# EAGLE design EXT-PHY (EAGLE 9.6.2)
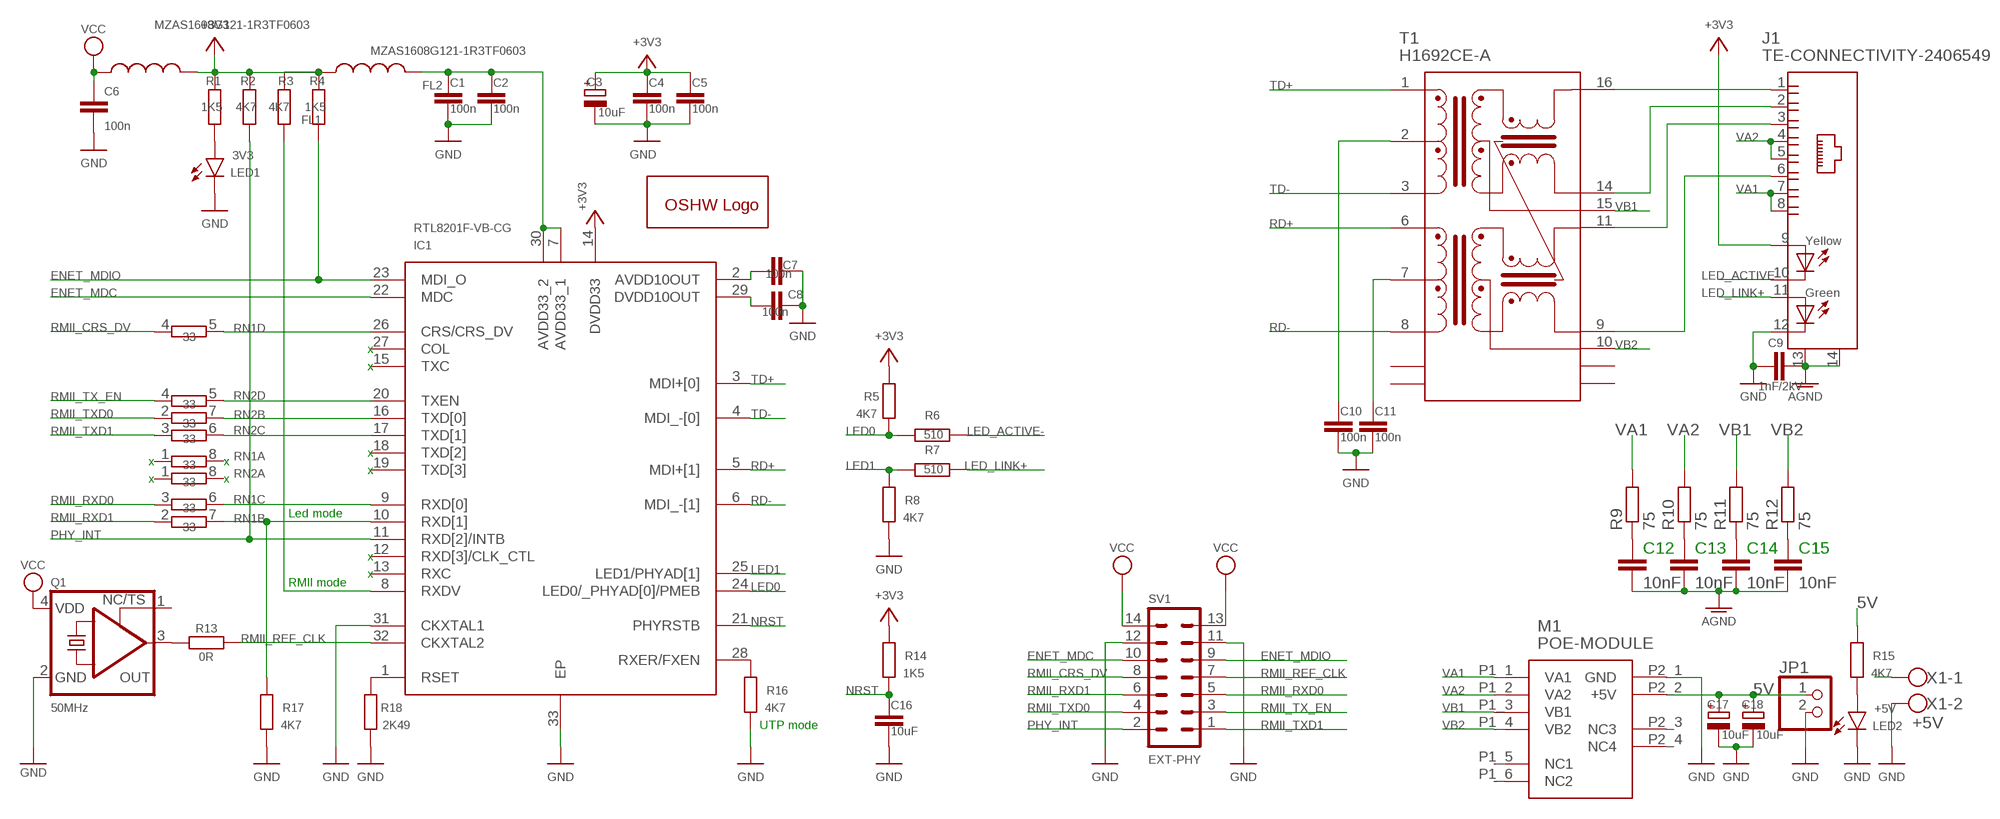
[diagram p0: schematic, sheet 1]

## Parts
C1  100n  C-EUC0603  [C0603]
C2  100n  C-EUC0603  [C0603]
C3  10uF  CPOL-EUA/3216-18R  [A/3216-18R]
C4  100n  C-EUC0603  [C0603]
C5  100n  C-EUC0603  [C0603]
C6  100n  C-EUC0603  [C0603]
C7  100n  C-EUC0603  [C0603]
C8  100n  C-EUC0603  [C0603]
C9  1nF/2kV  C-EUC1206  [C1206]
C10  100n  C-EUC0603  [C0603]
C11  100n  C-EUC0603  [C0603]
C12  10nF  C-EUC0805  [C0805]
C13  10nF  C-EUC0805  [C0805]
C14  10nF  C-EUC0805  [C0805]
C15  10nF  C-EUC0805  [C0805]
C16  10uF  C-EUC0603  [C0603]
C17  10uF  CPOL-EUA/3216-18R  [A/3216-18R]
C18  10uF  CPOL-EUA/3216-18R  [A/3216-18R]
FL1  MZAS1608G121-1R3TF0603  [0603]
FL2  MZAS1608G121-1R3TF0603  [0603]
GOLD_ORB_SM1  OSHWLOGOLOGO5MM  [OSHW_5MM]
IC1  RTL8201F-VB-CG  [QFN50P500X500X100-33N]
J1  TE-CONNECTIVITY-2406549  [34065493]
JP1  PINHD-1X2  [1X02]
LED1  3V3  LEDCHIP-LED0603  [CHIP-LED0603]
LED2  +5V  LEDCHIP-LED0603  [CHIP-LED0603]
M1  POE-MODULE  [POE-MODULE]
Q1  50MHz  KXO-PXO/XO-V96  [3.2X2.5_KXO-V96]
R1  1K5  R-EU_R0603  [R0603]
R2  4K7  R-EU_R0603  [R0603]
R3  4K7  R-EU_R0603  [R0603]
R4  1K5  R-EU_R0603  [R0603]
R5  4K7  R-EU_R0603  [R0603]
R6  510  R-EU_R0603  [R0603]
R7  510  R-EU_R0603  [R0603]
R8  4K7  R-EU_R0603  [R0603]
R9  75  R-EU_R0603  [R0603]
R10  75  R-EU_R0603  [R0603]
R11  75  R-EU_R0603  [R0603]
R12  75  R-EU_R0603  [R0603]
R13  0R  R-EU_R0603  [R0603]
R14  1K5  R-EU_R0603  [R0603]
R15  4K7  R-EU_R0603  [R0603]
R16  4K7  R-EU_R0603  [R0603]
R17  4K7  R-EU_R0603  [R0603]
R18  2K49  R-EU_R0603  [R0603]
RN1  33  4R-N0402ARV341  [4X0402ARV341]
RN2  33  4R-N0402ARV341  [4X0402ARV341]
SV1  EXT-PHY  MA07-2W  [MA07-2W]
T1  H1692CE-A  [SOIC127P952X572-16N]
X1  +5V  W237-102  [W237-102]

## Nets
5V: C17.+ C18.+ JP1.1 M1.P2_2(+5V) R15.2 X1.1
50MHZ: Q1.3(OUT) R13.1
+3V3: C3.+ C4.1 C5.1 FL1.2 FL2.1 IC1.14(DVDD33) J1.9(+_1) R1.2 R2.2 R3.1 R4.2 R5.2 R14.2
AGND: C9.2 C12.2 C13.2 C14.2 C15.2 J1.13(S1) J1.14(S2)
AVDD: C1.1 C2.1 FL2.2 IC1.7(AVDD33_1) IC1.30(AVDD33_2)
ENET_MDC: IC1.22(MDC) SV1.10
ENET_MDIO: IC1.23(MDI_O) R4.1 SV1.9
GND: C1.2 C2.2 C3.- C4.2 C5.2 C6.2 C7.2 C8.1 C9.1 C10.2 C11.2 C16.2 C17.- C18.- IC1.31(CKXTAL1) IC1.33(EP) J1.12(-_2) JP1.2 LED1.C LED2.C M1.P2_1(GND) Q1.2(GND) R8.1 R16.1 R17.1 R18.2 SV1.11 SV1.12 X1.2
LED0: IC1.24(LED0/_PHYAD[0]/PMEB) R5.1 R6.2
LED1: IC1.25(LED1/PHYAD[1]) R7.2 R8.2
LED_ACTIVE-: J1.10(-_1) R6.1
LED_LINK+: J1.11(+_2) R7.1
N$1: LED1.A R1.1
N$2: LED2.A R15.1
N$3: C10.1 T1.2
N$4: IC1.1(RSET) R18.1
N$5: IC1.8(RXDV) R3.2
N$6: C8.2 IC1.29(DVDD10OUT)
N$7: IC1.28(RXER/FXEN) R16.2
N$8: J1.1 T1.16
N$9: C12.1 R9.1
N$10: C13.1 R10.1
N$11: C7.1 IC1.2(AVDD10OUT)
N$12: J1.2 T1.14
N$13: J1.3 T1.11
N$14: J1.6 T1.9
N$15: C11.1 T1.7
N$16: C14.1 R11.1
N$17: C15.1 R12.1
NRST: C16.1 IC1.21(PHYRSTB) R14.1
PHY_INT: IC1.11(RXD[2]/INTB) R2.1 SV1.2
RD+: IC1.5(MDI+[1]) T1.6
RD-: IC1.6(MDI_-[1]) T1.8
RMII_CRS_DV: RN1.4 SV1.8
RMII_REF_CLK: IC1.32(CKXTAL2) R13.2 SV1.7
RMII_RXD0: RN1.3 SV1.5
RMII_RXD1: RN1.2 SV1.6
RMII_TX_EN: RN2.4 SV1.3
RMII_TXD0: RN2.2 SV1.4
RMII_TXD1: RN2.3 SV1.1
RXD0: IC1.9(RXD[0]) RN1.6
RXD1: IC1.10(RXD[1]) R17.2 RN1.7
RXDV: IC1.26(CRS/CRS_DV) RN1.5
TD+: IC1.3(MDI+[0]) T1.1
TD-: IC1.4(MDI_-[0]) T1.3
TXD0: IC1.16(TXD[0]) RN2.7
TXD1: IC1.17(TXD[1]) RN2.6
TXEN: IC1.20(TXEN) RN2.5
VA1: J1.7 J1.8 M1.P1_1(VA1) R9.2
VA2: J1.4 J1.5 M1.P1_2(VA2) R10.2
VB1: M1.P1_3(VB1) R11.2 T1.15
VB2: M1.P1_4(VB2) R12.2 T1.10
VCC: C6.1 FL1.1 Q1.4(VDD) SV1.13 SV1.14
Unconnected: IC1.12(RXD[3]/CLK_CTL) IC1.13(RXC) IC1.15(TXC) IC1.18(TXD[2]) IC1.19(TXD[3]) IC1.27(COL) M1.P1_5(NC1) M1.P1_6(NC2) M1.P2_3(NC3) M1.P2_4(NC4) Q1.1(TS) RN1.1 RN1.8 RN2.1 RN2.8 T1.4 T1.5 T1.12 T1.13

## Notes on the sheet
- x
- x
- x
- x | x
- x
- x | x
- Led mode
- x
- x
- RMII mode
- UTP mode

## Library data of the parts
C1 C2 C4-C8 C10 C11 = rcl:C-EU: CAPACITOR, European symbol; JLCPCB: C14663; SPICEPREFIX: C
C3 C17 C18 = rcl:CPOL-EU: POLARIZED CAPACITOR, European symbol; JLCPCB: C7171; SPICEPREFIX: C
C9 = rcl:C-EU: CAPACITOR, European symbol; JLCPCB: C9196; SPICEPREFIX: C
C12-C15 = rcl:C-EU: CAPACITOR, European symbol; JLCPCB: C106844; SPICEPREFIX: C
C16 = rcl:C-EU: CAPACITOR, European symbol; JLCPCB: C19702; SPICEPREFIX: C
FL1 FL2 = Ethernet:MZAS1608G121-1R3TF: 1.3A 1 140mΩ 120Ω@100MHz ±25% 0603 Ferrite Beads ROHS; JLCPCB: C709642
GOLD_ORB_SM1 = oshw:OSHWLOGO: The OSHW logo for PCB layout
IC1 = Ethernet:RTL8201F-VB-CG: RTL8201F Series 3.63 V Single Chip/Port 10/100 M Ethernet Phyceiver w/ auto MDIX Source: Datasheet <https://pdf1.alldatasheet.com/datasheet-pdf/view/1132250/REALTEK/RTL8201F-VB-CG.html>; DESCRIPTION: RTL8201F Series 3.63 V Single Chip/Port 10/100 M Ethernet Phyceiver w/ auto MDIX; JLCPCB: C45044; MANUFACTURER_NAME: Realtek; MANUFACTURER_PART_NUMBER: RTL8201F-VB-CG
J1 = Ethernet:TE-CONNECTIVITY-2406549: Mod Jack RJ45 CAT 5 Right Angle TE Connectivity 2406549, Cat5 RJ45 Modular Jack Socket, STP, Right Angle, PCB Mount Source: Datasheet <https://componentsearchengine.com/Datasheets/1/2-406549-1.pdf>; DESCRIPTION: Mod Jack RJ45 CAT 5 Right Angle TE Connectivity 2406549, Cat5 RJ45 Modular Jack Socket, STP, Right Angle, PCB Mount; HEIGHT: 14mm; JLCPCB: C125068; MANUFACTURER_NAME: TE Connectivity; MANUFACTURER_PART_NUMBER: 2-406549-1
JP1 = pinhead:PINHD-1X2: PIN HEADER
LED1 LED2 = led:LED: LED OSRAM: - CHIPLED LG R971, LG N971, LY N971, LG Q971, LY Q971, LO R971, LY R971 LH N974, LH R974 LS Q976, LO Q976, LY Q976 LO Q996 - Hyper CHIPLED LW Q18S LB Q993, LB Q99A, LB R99A - SideLED LS A670, LO A670, LY A670, LG A670, LP A670 LB A673, LV A673, LT A673, LW A673 LH A674 LY A675 LS A676, LA A676, LO A676, LY A676, LW A676 LS A679, LY A679, LG A679 - Hyper Micro SIDELED® LS Y876, LA Y876, LO Y876, LY Y876 LT Y87S - SmartLED LW L88C, LW L88S LB L89C, LB L89S, LG L890 LS L89K, LO L89K, LY L89K LS L896, LA L896, LO L896, LY L896 - TOPLED LS T670, LO T670, LY T670, LG T670, LP T670 LSG T670, LSP T670, LSY T670, LOP T670, LYG T670 LG T671, LOG T671, LSG T671 LB T673, LV T673, LT T673, LW T673 LH T674 LS T676, LA T676, LO T676, LY T676, LB T676, LH T676, LSB T676, LW T676 LB T67C, LV T67C, LT T67C, LS T67K, LO T67K, LY T67K, LW E67C LS E67B, LA E67B, LO E67B, LY E67B, LB E67C, LV E67C, LT E67C LW T67C LS T679, LY T679, LG T679 LS T770, LO T770, LY T770, LG T770, LP T770 LB T773, LV T773, LT T773, LW T773 LH T774 LS E675, LA E675, LY E675, LS T675 LS T776, LA T776, LO T776, LY T776, LB T776 LHGB T686 LT T68C, LB T68C - Hyper Mini TOPLED® LB M676 - Mini TOPLED Santana® LG M470 LS M47K, LO M47K, LY M47K Source: http://www.osram.convergy.de LUXEON: - LUMILED® LXK2-PW12-R00, LXK2-PW12-S00, LXK2-PW14-U00, LXK2-PW14-V00 LXK2-PM12-R00, LXK2-PM12-S00, LXK2-PM14-U00 LXK2-PE12-Q00, LXK2-PE12-R00, LXK2-PE12-S00, LXK2-PE14-T00, LXK2-PE14-U00 LXK2-PB12-K00, LXK2-PB12-L00, LXK2-PB12-M00, LXK2-PB14-N00, LXK2-PB14-P00, LXK2-PB14-Q00 LXK2-PR12-L00, LXK2-PR12-M00, LXK2-PR14-Q00, LXK2-PR14-R00 LXK2-PD12-Q00, LXK2-PD12-R00, LXK2-PD12-S00 LXK2-PH12-R00, LXK2-PH12-S00 LXK2-PL12-P00, LXK2-PL12-Q00, LXK2-PL12-R00 Source: www.luxeon.com KINGBRIGHT: KA-3528ASYC Source: www.kingbright.com; JLCPCB: C72043
M1 = Ethernet:POE-MODULE: Isolated Output PoE Module
Q1 = crystal-geyer_V1_0:KXO-PXO/XO-V: Clock Oscillator (PXO/XO) MHz : KXO-V - Serie Model Size l/w/h [mm] Frequency Range Frequency Stability Temp. Range [°C] Output AECQ 200 availabel Datasheet KXO-V94 KXO-V94 KXO-V95 KXO-V95 KXO-V96 KXO-V96 KXO-V99 KXO-V99 KXO-97 KXO-V97 KXO-97 - KXO-V97 2.0/1.6/0.80 2.0/1.6/0.80 2.5/2.0/0.82 2.5/2.0/0.82 3.2/2.5/1.2 3.2/2.5/1.2 5.0/3.2/1.2 5.0/3.2/1.2 7.0/5.08/1.3 7.0/5.08/1.3 7.0/5.08/1.3 32,768 kHz 1,0 ~ 80,0 MHz 32,768 kHz 1,0 ~ 70,0 MHz 32,768 kHz 1,0 ~ 156,0 MHz 32,768 kHz 1,0 ~ 200,0 MHz 32,768 kHz 32,768 kHz 1,0 ~ 160,0 MHz ±25 … ±100ppm ±25 … ±100ppm ±25 … ±100ppm ±25 … ±100ppm ±25 … ±100ppm ±25 … ±100ppm ±25 … ±100ppm ±25 … ±100ppm ±25 … ±100ppm ±25 … ±100ppm ±25 … ±100ppm (*) -40°C …+85°C (*) -40°C …+85°C (*) -40°C …+85°C (*) -40°C …+85°C (*) -40°C …+85°C (*) -40°C …+85°C (*) -40°C …+85°C (*) -40°C …+85°C (*) -40°C …+85°C (*) -40°C …+85°C (*) -40°C …+85°C HCMOS HCMOS HCMOS HCMOS HCMOS HCMOS HCMOS HCMOS HCMOS HCMOS HCMOS - - yes yes yes yes - - - - - KXO-V94-kHz.pdf <http://www.geyer-electronic.de/uploads/tx_userartikelfrequenz/GEYER-KXO-V94-kHz.pdf> KXO-V94.pdf <http://www.geyer-electronic.de/uploads/tx_userartikelfrequenz/GEYER-KXO-V94.pdf> KXO-V95-kHz.pdf <http://www.geyer-electronic.de/uploads/tx_userartikelfrequenz/GEYER-KXO-V95-kHz.pdf> KXO-V95.pdf <http://www.geyer-electronic.de/uploads/tx_userartikelfrequenz/GEYER-KXO-V95.pdf> KXO-V96-kHz.pdf <http://www.geyer-electronic.de/uploads/tx_userartikelfrequenz/GEYER-KXO-V96-kHz.pdf> KXO-V96.pdf <http://www.geyer-electronic.de/uploads/tx_userartikelfrequenz/GEYER-KXO-V96.pdf> KXO-V99-kHz.pdf <http://www.geyer-electronic.de/uploads/tx_userartikelfrequenz/GEYER-KXO-V99-kHz.pdf> KXO-V99.pdf <http://www.geyer-electronic.de/uploads/tx_userartikelfrequenz/GEYER-KXO-V99.pdf> KXO-97-kHz.pdf <http://www.geyer-electronic.de/uploads/tx_userartikelfrequenz/GEYER-KXO-97-kHz.pdf> KXO-V97-kHz.pdf <http://www.geyer-electronic.de/uploads/tx_userartikelfrequenz/GEYER-KXO-V97-kHz.pdf> KXO-V97.pdf <http://www.geyer-electronic.de/uploads/tx_userartikelfrequenz/GEYER-KXO-V97.pdf> <http://www.geyer-electronic.de/fileadmin/template/img/logo-geyer-electronic.png> Details see: http://www.geyer-electronic.de/Frequenz-Produkte.9.0.html Created 2016-06-07, Hans Locher 2016 (C) Geyer Quartz Technology Hans Locher KXOV94,KXOV95;KXOV96;KXOV97;KXO97;2016;2520;3225;5032;70508;2,5x2,0;3,2x2,5;5,0x3,2;7,0x5,08;2.5x2.0;3.2x2.5;5.0x3.2;7.0x5.08;; JLCPCB: C160451
R1 R4 R14 = rcl:R-EU_: RESISTOR, European symbol; JLCPCB: C22843; SPICEPREFIX: R
R2 R3 R5 R8 R15-R17 = rcl:R-EU_: RESISTOR, European symbol; JLCPCB: C23162; SPICEPREFIX: R
R6 R7 = rcl:R-EU_: RESISTOR, European symbol; JLCPCB: C23193; SPICEPREFIX: R
R9-R12 = rcl:R-EU_: RESISTOR, European symbol; JLCPCB: C228048; SPICEPREFIX: R
R13 = rcl:R-EU_: RESISTOR, European symbol; JLCPCB: C115304; SPICEPREFIX: R
R18 = rcl:R-EU_: RESISTOR, European symbol; JLCPCB: C100897; SPICEPREFIX: R
RN1 RN2 = resistor-dil:4R-N: Array Chip Resistor Source: RS Component / Phycomp; JLCPCB: C25501; OC_FARNELL: unknown; OC_NEWARK: unknown
SV1 = con-lstb:MA07-2W: PIN HEADER; OC_FARNELL: unknown; OC_NEWARK: unknown
T1 = Ethernet:H1692CE-A: 10/100 BASE-T SINGLE PORT SURFACE MOUNT MAGNETICS POE; JLCPCB: C2904705; MANUFACTURER: Dongguan Mentech Optical & Magnetic; MANUFACTURERPART: H1692CE-A
X1 = con-wago-500:W237-102: WAGO SCREW CLAMP; MPN: 237-102; OC_FARNELL: unknown; OC_NEWARK: 70K9898

## Board
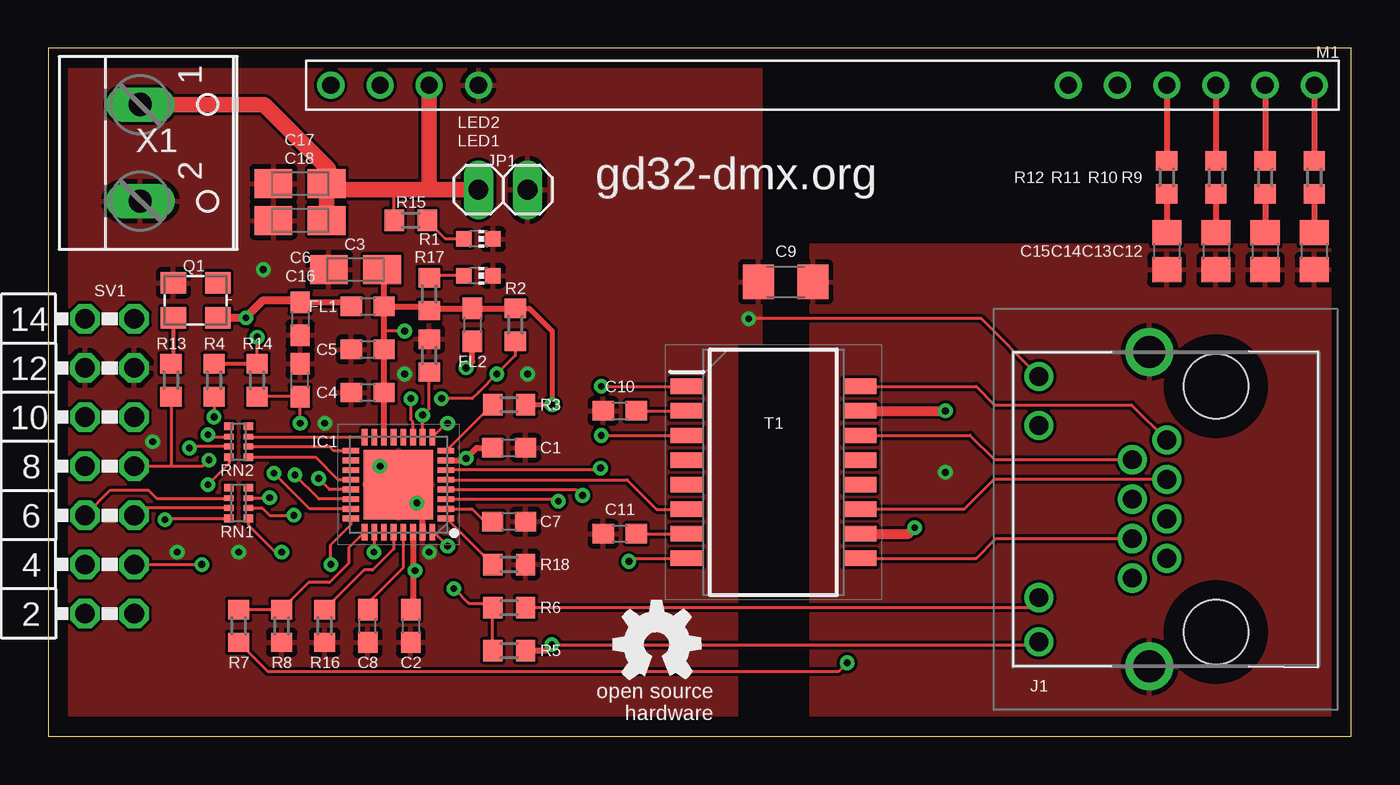
[diagram p1: board, top side]
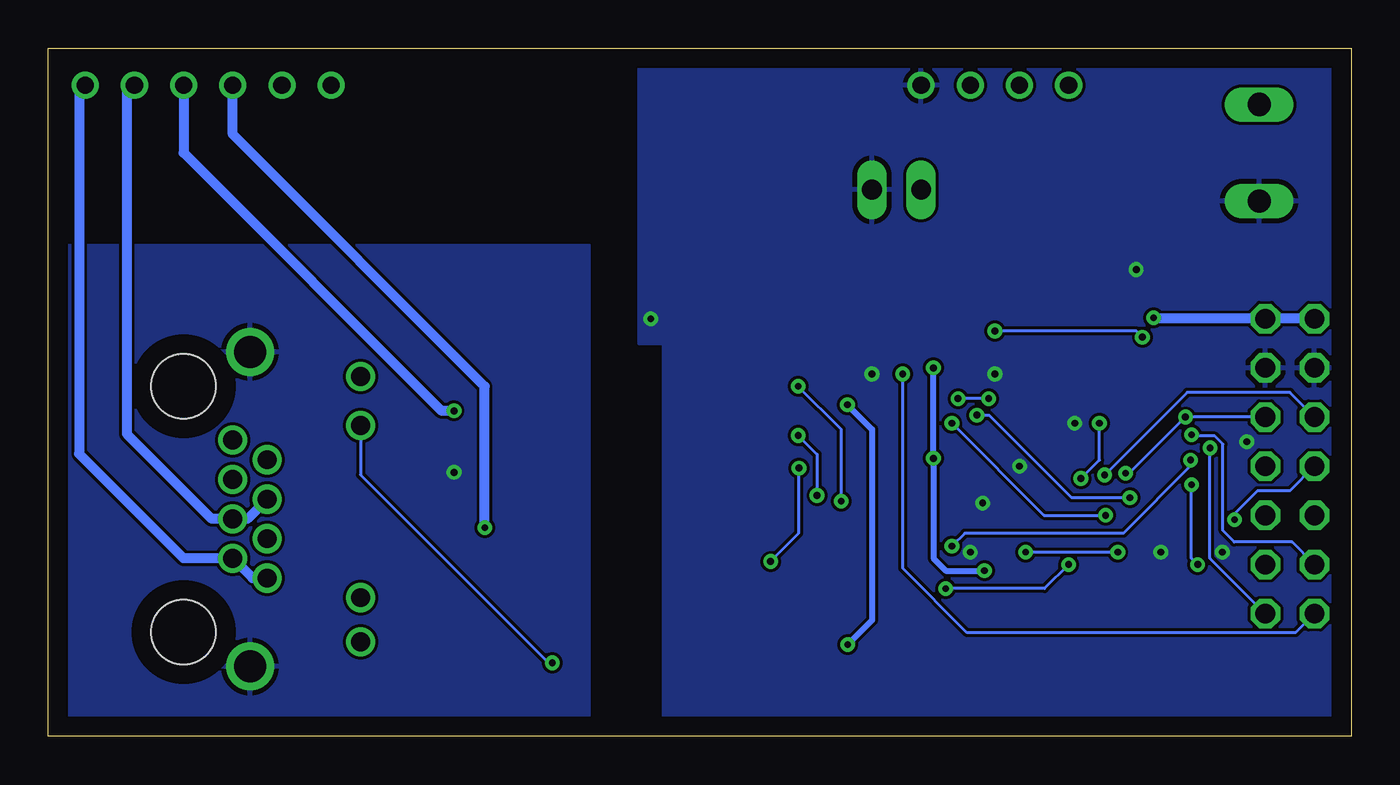
[diagram p2: board, bottom side, seen from below]

Size 67.3 x 35.55 mm. Coordinates in mm from the lower left corner, seen from the top.
Outline: 67.3,35.55 0,35.55 0,0 67.3,0 67.3,35.55
Copper layers (1*16): Top 0.035mm / dielectric 1.5mm / Bottom 0.035mm
Design rules "default": minimum track width 6mil, minimum drill 0.35mm, track to track 6mil, track to pad 6mil, pad to pad 6mil, via to via 6mil, smd to smd 6mil, copper to edge 40mil, drill to drill 6mil, minimum pad ring 10mil, minimum via ring 8mil, stop-mask expansion 4mil, vias tented up to drill 0mil, thermal gap 10mil

### Footprints (pad centres in the part's own frame; a part is rotated, then mirrored left to right if it is on the bottom)
C0603 = smd 1.1 x 1: 1 -0.85,0; 2 0.85,0
A/3216-18R = smd 1.95 x 1.5: + 1.375,0; - -1.375,0
C1206 = smd 1.6 x 1.8: 1 -1.4,0; 2 1.4,0
C0805 = smd 1.3 x 1.5: 1 -0.95,0; 2 0.95,0
0603 = smd 1.1 x 1: 1 -0.85,0; 2 0.85,0
QFN50P500X500X100-33N = smd 0.85 x 0.3: 1 -2.45,1.75; 2 -2.45,1.25; 3 -2.45,0.75; 4 -2.45,0.25; 5 -2.45,-0.25; 6 -2.45,-0.75; 7 -2.45,-1.25; 8 -2.45,-1.75; 17 2.45,-1.75; 18 2.45,-1.25; 19 2.45,-0.75; 20 2.45,-0.25; 21 2.45,0.25; 22 2.45,0.75; 23 2.45,1.25; 24 2.45,1.75 | smd 0.3 x 0.85: 9 -1.75,-2.45; 10 -1.25,-2.45; 11 -0.75,-2.45; 12 -0.25,-2.45; 13 0.25,-2.45; 14 0.75,-2.45; 15 1.25,-2.45; 16 1.75,-2.45; 25 1.75,2.45; 26 1.25,2.45; 27 0.75,2.45; 28 0.25,2.45; 29 -0.25,2.45; 30 -0.75,2.45; 31 -1.25,2.45; 32 -1.75,2.45 | smd 3.6 x 3.6: 33 0,0
34065493 = drill 0.97 pad 1.509: 1 3.58,2.54; 2 2.56,4.32; 3 1.54,2.54; 4 0.52,4.32; 5 -0.5,2.54; 6 -1.52,4.32; 7 -2.54,2.54; 8 -3.56,4.32; 9 -6.86,9.14; 10 -4.57,9.14; 11 4.32,9.14; 12 6.86,9.14 | drill 1.65 pad 2.475: 13 -8.13,3.43; 14 8.13,3.43 | hole 3.33: -6.35,0; 6.35,0
1X02 = drill 1.016 long: 1 -1.27,0; 2 1.27,0
CHIP-LED0603 = smd 0.8 x 0.8: A 0,-0.75; C 0,0.75
POE-MODULE = drill 0.89: P1_1 1.27,1.27; P1_2 3.81,1.27; P1_3 6.35,1.27; P1_4 8.89,1.27; P1_5 11.43,1.27; P1_6 13.97,1.27; P2_1 44.45,1.27; P2_2 46.99,1.27; P2_3 49.53,1.27; P2_4 52.07,1.27
3.2X2.5_KXO-V96 = smd 1.3 x 1.1: 1 -1.15,-0.9; 2 1.15,-0.9; 3 1.15,0.9; 4 -1.15,0.9
R0603 = smd 1 x 1.1: 1 -0.85,0; 2 0.85,0
4X0402ARV341 = smd 0.4 x 0.5: 1 -0.8,-0.5; 4 0.8,-0.5; 5 0.8,0.5; 8 -0.8,0.5 | smd 0.3 x 0.5: 2 -0.25,-0.5; 3 0.25,-0.5; 6 0.25,0.5; 7 -0.25,0.5
MA07-2W = drill 1.016 octagon: 1 -7.62,-1.27; 2 -7.62,1.27; 3 -5.08,-1.27; 4 -5.08,1.27; 5 -2.54,-1.27; 6 -2.54,1.27; 7 0,-1.27; 8 0,1.27; 9 2.54,-1.27; 10 2.54,1.27; 11 5.08,-1.27; 12 5.08,1.27; 13 7.62,-1.27; 14 7.62,1.27
SOIC127P952X572-16N = smd 1.706 x 0.8: 1 -4.472,4.445; 2 -4.472,3.175; 3 -4.472,1.905; 4 -4.472,0.635; 5 -4.472,-0.635; 6 -4.472,-1.905; 7 -4.472,-3.175; 8 -4.472,-4.445; 9 4.472,-4.445; 10 4.472,-3.175; 11 4.472,-1.905; 12 4.472,-0.635; 13 4.472,0.635; 14 4.472,1.905; 15 4.472,3.175; 16 4.472,4.445
W237-102 = drill 1.194 long: 1 -2.5,-1.27; 2 2.5,-1.27

### Placement (x,y rotation side)
C1  23.8,14.91 0 top
C2  18.72,5.71 270 top
C3  15.86,24.12 0 top
C4  16.5,17.77 180 top
C5  16.5,19.99 180 top
C6  13.01,21.58 270 top
C7  23.8,11.1 0 top
C8  16.5,5.71 90 top
C9  38.09,23.48 0 top
C10  29.52,16.82 180 top
C11  29.52,10.47 180 top
C12  65.39,25.07 270 top
C13  62.85,25.07 270 top
C14  60.31,25.07 270 top
C15  57.77,25.07 270 top
C16  13.01,18.4 90 top
C17  13.01,28.56 0 top
C18  13.01,26.66 0 top
FL1  16.5,22.21 0 top
FL2  21.89,21.26 270 top
GOLD_ORB_SM1  31.42,4.75 0 top
IC1  18.09,13.01 180 top
J1  60.31,11.74 90 top
JP1  23.48,28.25 0 top
LED1  22.21,23.8 270 top
LED2  22.21,25.71 270 top
M1  66.66,34.91 180 top
Q1  7.61,22.53 180 top
R1  19.67,22.85 270 top
R2  24.12,21.26 90 top
R3  23.8,17.13 180 top
R4  8.56,18.4 90 top
R5  23.8,4.44 0 top
R6  23.8,6.66 180 top
R7  9.83,5.71 90 top
R8  12.05,5.71 90 top
R9  65.39,28.88 90 top
R10  62.85,28.88 90 top
R11  60.31,28.88 90 top
R12  57.77,28.88 90 top
R13  6.34,18.4 270 top
R14  10.78,18.4 90 top
R15  18.72,26.66 180 top
R16  14.28,5.71 90 top
R17  19.67,19.67 270 top
R18  23.8,8.88 0 top
RN1  9.83,12.05 270 top
RN2  9.83,15.23 270 top
SV1  3.16,13.96 90 top
T1  37.45,13.64 0 top
X1  6.02,30.15 270 top

### Tracks (layer width: path | path; a pad name or v marks a point on that pad's centre or on a via)
5V
  Top 0.152: R15.2 17.87,28.14 17.77,28.25
  Top 0.813: X1.1 11.14,32.65 14.49,29.3 14.49,28.67 C17.+ 14.38,28.25 | JP1.1 19.67,28.25 | 19.67,28.25 17.77,28.25 14.38,28.25 | 14.38,28.25 C18.+ | M1.P2_2 19.67,28.25
50MHZ
  Top 0.203: Q1.3 6.46,19.38 R13.1
+3V3  (via drill 0.35)
  Top 0.152: R5.2 25.04,4.44 | R14.2 v10.78,20.63 | v18.4,20.94 17.35,20.94 | v26.01,4.74 51.03,4.74 J1.9
  Top 0.2: R4.2 R14.2
  Top 0.254: R1.2 19.78,22.11 | R2.2 24.85,22.11 26.02,20.94 v26.02,17.13 R3.1
  Top 0.305: FL1.2 17.35,20.94 C5.1 C4.1 17.34,17.76 IC1.14 | FL1.2 17.35,24.01 C3.+ | FL1.2 19.46,22.21 R1.2 | 19.78,22.11 FL2.1 R2.2 | 25.04,4.44 25.71,4.44 v26.01,4.74
  Bottom 0.152: v10.78,20.63 11.1,20.94 v18.4,20.94
  Bottom 0.305: v26.01,4.74 24.75,6 24.75,15.87 v26.02,17.13
AGND  (via drill 0.35)
  other vias: 46.34,13.64
  pour Top: 67.3,25.39 39.36,25.39 39.36,0.94 67.3,0.94
  pour Bottom: 67.3,25.39 39.36,25.39 39.36,0.94 67.3,0.94
AVDD  (via drill 0.35)
  Top 0.305: C2.1 19.04,6.56 18.84,6.76 18.84,8.56 | v18.94,8.56 18.84,8.56 | IC1.30 18.84,8.56 | IC1.7 21.47,14.26 v21.58,14.36 22.13,14.91 C1.1 | v21.58,19.04 21.89,19.36 FL2.2
  Bottom 0.305: v18.94,8.56 20.94,8.56 21.58,9.2 v21.58,14.36 v21.58,19.04
ENET_MDC  (via drill 0.35)
  Top 0.152: v12.73,13.51 13.98,12.26 IC1.22
  Bottom 0.152: SV1.10 3.16,17.77 8.47,17.77 v12.73,13.51
ENET_MDIO  (via drill 0.35)
  Top 0.152: v11.65,13.6 13.49,11.76 IC1.23 | R4.1 v8.56,16.5
  Bottom 0.152: SV1.9 v8.56,16.5 11.46,13.6 v11.65,13.6
GND  (via drill 0.35)
  Top 0.152: J1.12 48.19,21.58 v36.18,21.58
  Top 0.305: IC1.31 19.34,11.76 IC1.33
  other vias: 11.1,24.12 9.83,9.52 19.67,9.52 18.4,18.72 5.38,15.23 19.04,12.05 17.13,13.96 6.66,9.52 24.75,18.72 14.28,16.18
  pour Top: -0.01,35.55 36.82,35.55 36.82,20.31 35.55,20.31 35.55,-0.01 -0.01,-0.01
  pour Bottom: -0.01,35.55 36.82,35.55 36.82,20.31 35.55,20.31 35.55,-0.01 -0.01,-0.01
LED0  (via drill 0.35)
  Top 0.152: v20.95,7.64 21.71,6.87 22.95,6.87 R6.2 R5.1 | v14.59,8.88 14.59,9.9 15.64,10.94 IC1.24
  Bottom 0.152: v14.59,8.88 15.84,7.64 v20.95,7.64
LED1
  Top 0.152: R7.2 R8.2 13.45,7.96 14.53,7.96 15.52,8.95 15.52,9.74 IC1.25
LED_ACTIVE-
  Top 0.152: R6.1 50.66,6.66 J1.10
LED_LINK+  (via drill 0.35)
  Top 0.152: v41.26,3.8 40.8,3.34 11.35,3.34 R7.1
  Bottom 0.152: v41.26,3.8 41.46,3.8 51.17,13.52 J1.11
N$1
  Top 0.152: LED1.A 19.78,23.8 R1.1
N$2
  Top 0.152: LED2.A 20.52,25.71 R15.1
N$3
  Top 0.152: C10.1 T1.2
N$4
  Top 0.152: IC1.1 20.57,11.26 R18.1
N$5
  Top 0.152: R3.2 22.91,17.13 IC1.8
N$6
  Top 0.152: IC1.29 18.34,8.71 16.5,6.87 C8.2
N$7
  Top 0.152: R16.2 16.31,8.59 16.75,8.59 17.84,9.68 IC1.28
N$8
  Top 0.152: T1.16 47.93,18.09 48.88,17.13 55.96,17.13 J1.1
N$9
  Top 0.305: R9.1 C12.1
N$10
  Top 0.305: R10.1 C13.1
N$11
  Top 0.152: IC1.2 21.87,11.76 22.53,11.1 C7.1
N$12
  Top 0.152: T1.14 47.61,15.55 48.86,14.3 J1.2
N$13
  Top 0.152: T1.11 47.29,11.74 48.83,13.28 J1.3
N$14
  Top 0.152: T1.9 47.93,9.2 48.95,10.22 J1.6
N$15
  Top 0.152: C11.1 T1.7
N$16
  Top 0.305: R11.1 C14.1
N$17
  Top 0.305: R12.1 C15.1
NRST  (via drill 0.35)
  Top 0.152: v13.96,13.33 14.52,12.76 IC1.21 | v13.01,16.18 C16.1 R14.1
  Bottom 0.152: v13.96,13.33 13.01,14.28 v13.01,16.18
PHY_INT  (via drill 0.35)
  Top 0.152: v20.31,17.45 21.89,17.45 22.22,17.78 v23.16,18.72 24.12,19.68 R2.1 | IC1.11 18.84,16.24 18.73,16.35 v18.73,17.44 v18.72,17.45
  Bottom 0.152: v18.72,17.45 v20.31,17.45 | SV1.2 2.88,5.35 19.84,5.35 23.16,8.68 v23.16,18.72 | v23.16,18.72
RD+
  Top 0.152: IC1.5 29.9,13.26 31.42,11.74 T1.6
RD-  (via drill 0.35)
  Top 0.152: v28.52,13.86 28.42,13.76 IC1.6 | v29.99,9.04 30.15,9.2 T1.8
  Bottom 0.152: v29.99,9.04 28.52,10.51 v28.52,13.86
RMII_CRS_DV  (via drill 0.35)
  Top 0.152: v6.02,11.2 6.08,11.26 RN1.4
  Bottom 0.152: v6.02,11.2 6.02,11.52 4.85,12.69 3.16,12.69 SV1.8
RMII_REF_CLK  (via drill 0.35)
  Top 0.152: v8.3,14.28 7.98,13.96 SV1.7 6.34,13.96 R13.2 | IC1.32 19.9,10.56 v20.62,9.83
  Bottom 0.152: v20.62,9.83 19.96,10.5 11.76,10.5 8.3,13.96 v8.3,14.28
RMII_RXD0
  Top 0.152: SV1.5 4.82,11.8 RN1.3
RMII_RXD1
  Top 0.152: SV1.6 3.2,12.73 5.16,12.73 5.58,12.3 RN1.2
RMII_TX_EN  (via drill 0.35)
  Top 0.152: RN2.4 9.33,14.1 v8.24,13.01 | SV1.3 v7.93,8.88
  Bottom 0.152: v7.93,8.88 8.24,9.2 v8.24,13.01
RMII_TXD0  (via drill 0.35)
  Top 0.152: v8.24,15.59 8.35,15.48 RN2.2
  Bottom 0.152: v8.24,15.59 8.17,15.51 7.04,15.51 6.63,15.1 6.63,10.63 6.04,10.04 3.05,10.04 SV1.4
RMII_TXD1  (via drill 0.35)
  Top 0.152: RN2.3 7.37,14.98 v7.29,14.9
  Bottom 0.152: SV1.1 7.29,9.2 v7.29,14.9
RXD0  (via drill 0.35)
  Top 0.152: RN1.6 11.03,11.8 11.42,11.42 v12.69,11.42 | IC1.9 20.56,16.18 v20.62,16.18
  Bottom 0.152: v20.62,16.18 15.86,11.42 v12.69,11.42
RXD1  (via drill 0.35)
  Top 0.152: v11.43,12.33 11.4,12.3 RN1.7 | R17.2 19.67,16.94 v19.34,16.6 IC1.10
  Bottom 0.152: v19.34,16.6 18.7,16.6 14.43,12.33 v11.43,12.33
RXDV  (via drill 0.35)
  Top 0.152: RN1.5 10.33,10.94 11.75,9.52 v12.05,9.52 | IC1.26 16.84,9.54 v16.82,9.52
  Bottom 0.152: v12.05,9.52 v16.82,9.52
TD+  (via drill 0.35)
  Top 0.152: v26.34,12.15 26.23,12.26 IC1.3 | v28.56,18.09 T1.1
  Bottom 0.152: v26.34,12.15 26.34,15.87 v28.56,18.09
TD-  (via drill 0.35)
  Top 0.152: v28.56,15.55 T1.3 | IC1.4 27.28,12.76 v27.59,12.45
  Bottom 0.152: v27.59,12.45 27.59,14.58 v28.56,15.55
TXD0
  Top 0.152: RN2.7 16.31,15.48 IC1.16
TXD1
  Top 0.152: RN2.6 14.52,14.98 14.75,14.76 IC1.17
TXEN
  Top 0.152: RN2.5 13.81,14.43 14.98,13.26 IC1.20
VA1
  Top 0.305: M1.P1_1 R9.2
  Bottom 0.508: J1.8 56.75,8.18 J1.7 60.31,9.2 65.71,14.6 65.71,33.33 M1.P1_1
VA2
  Top 0.305: M1.P1_2 R10.2
  Bottom 0.508: M1.P1_2 63.25,33.25 63.25,15.62 58.86,11.24 J1.5 57.01,11.24 J1.4
VB1  (via drill 0.35)
  Top 0.305: M1.P1_3 R11.2
  Top 0.508: T1.15 v46.34,16.82
  Bottom 0.508: M1.P1_3 60.31,30.15 46.98,16.82 v46.34,16.82
VB2  (via drill 0.35)
  Top 0.305: M1.P1_4 R12.2
  Top 0.508: T1.10 44.44,10.47 v44.75,10.79
  Bottom 0.508: v44.75,10.79 44.75,18.09 57.77,31.1 M1.P1_4
VCC  (via drill 0.35)
  Top 0.305: C6.1 15.43,22.43 FL1.1
  Top 0.406: C6.1 12.9,22.53 11.1,22.53 v10.2,21.63 Q1.4
  Bottom 0.406: 10.15,21.58 v10.2,21.63
  Bottom 0.508: 10.15,21.58 SV1.13 SV1.14

### Text on the board
tNames: gd32-dmx.org
tValues: + | +5V | GND | + | + | + | + | +